# Altium schematic sheet MCU.SchDoc
size A3
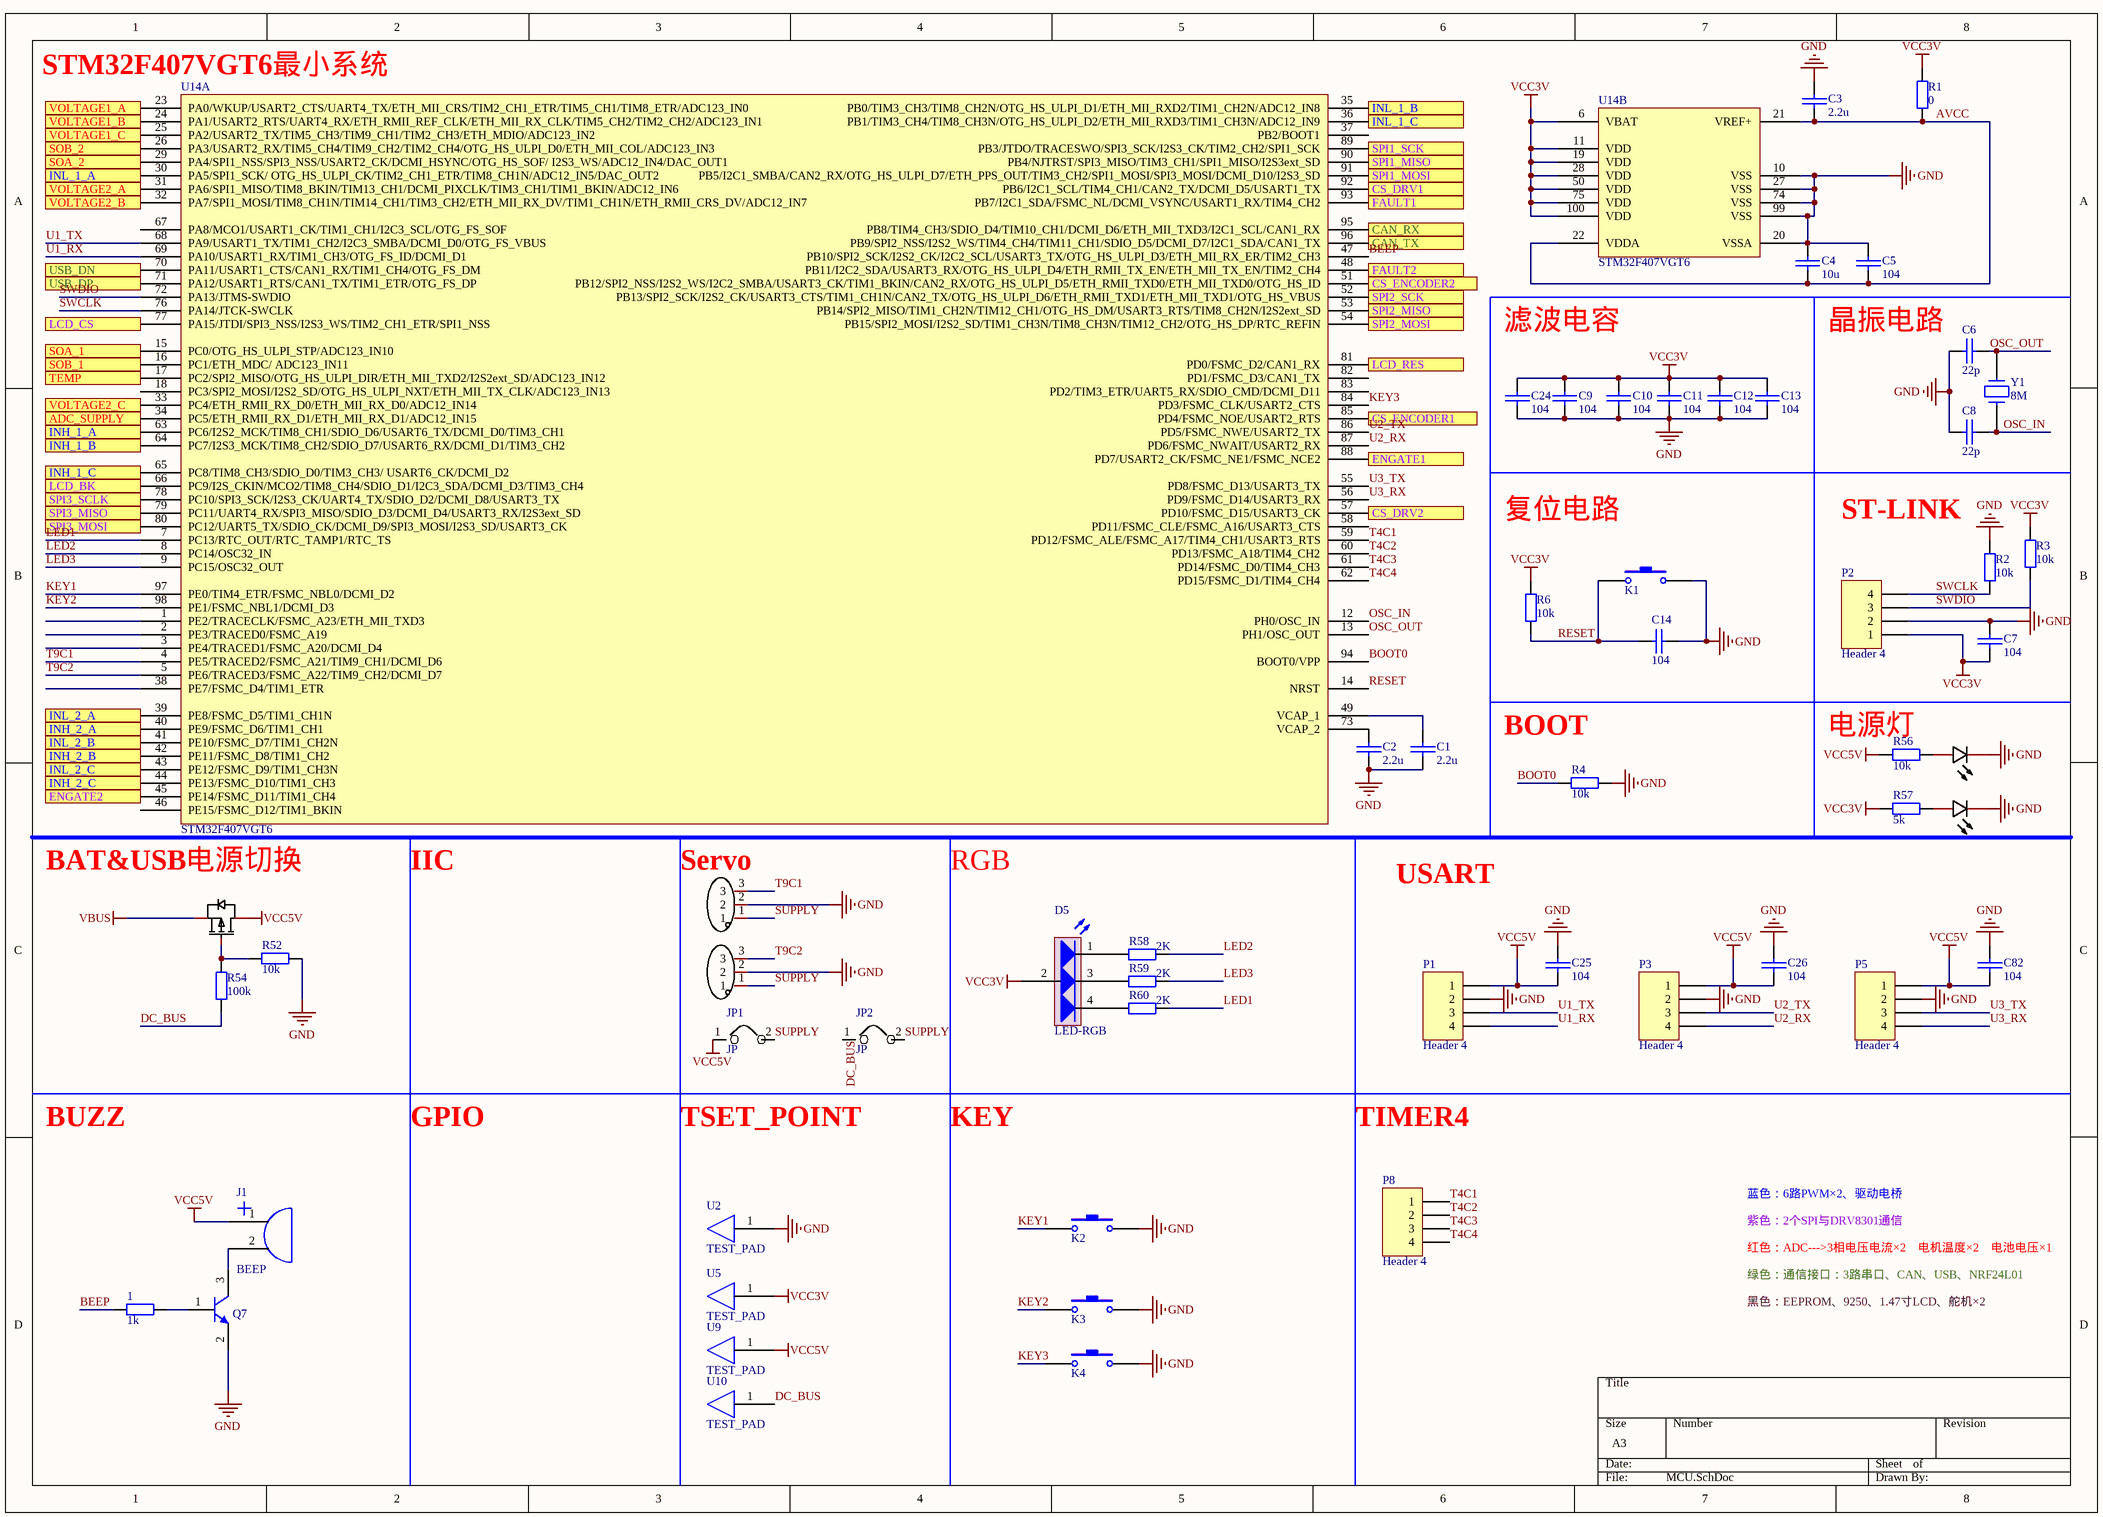
[diagram p0: MCU.SchDoc]

## Parts
1  1k  [0402C]
2  NCD0603R1_C84263  [0603LED]  (value not drawn)
3  NCD0603R1_C84263  [0603LED]  (value not drawn)
C1  value 2.2u  [0402C]  (hidden comment: CAP)
C2  value 2.2u  [0402C]  (hidden comment: CAP)
C3  value 2.2u  [0402C]  (hidden comment: CAP)
C4  value 10u  [0402C]  (hidden comment: CAP)
C5  value 104  [0402C]  (hidden comment: CAP)
C6  value 22p  [0402C]  (hidden comment: CAP)
C7  value 104  [0402C]  (hidden comment: CAP)
C8  value 22p  [0402C]  (hidden comment: CAP)
C9  value 104  [0402C]  (hidden comment: CAP)
C10  value 104  [0402C]  (hidden comment: CAP)
C11  value 104  [0402C]  (hidden comment: CAP)
C12  value 104  [0402C]  (hidden comment: CAP)
C13  value 104  [0402C]  (hidden comment: CAP)
C14  104  [0402C]
C24  value 104  [0402C]  (hidden comment: CAP)
C25  104  [0402C]
C26  104  [0402C]
C82  104  [0402C]
D5  LED-RGB  [RGB]
J1  BEEP  [无源蜂鸣器5020]
JP1  JP  [跳线]
JP2  JP  [跳线]
K1  KEY  [KEY-SMD_L3.9-W3.0-P4.45]  (value not drawn)
K2  KEY  [KEY-SMD_L3.9-W3.0-P4.45]  (value not drawn)
K3  KEY  [KEY-SMD_L3.9-W3.0-P4.45]  (value not drawn)
K4  KEY  [KEY-SMD_L3.9-W3.0-P4.45]  (value not drawn)
P1  Header 4  [A1002WR-S-4P]
P2  Header 4  [A1002WR-S-4P]
P3  Header 4  [A1002WR-S-4P]
P5  Header 4  [A1002WR-S-4P]
P8  Header 4  [A1002WR-S-4P]
Q7  NPN  [SOT-23Q]  (value not drawn)
Q15  AO3401_C727156  [SOT-23Q]  (value not drawn)
R1  0  [0402R]
R2  10k  [0402R]
R3  10k  [0402R]
R4  10k  [0402R]
R6  10k  [0402R]
R52  10k  [0402R]
R54  100k  [0402R]
R56  10k  [0402R]
R57  5k  [0402R]
R58  value 2K  [0402R]  (hidden comment: Res1)
R59  value 2K  [0402R]  (hidden comment: Res1)
R60  value 2K  [0402R]  (hidden comment: Res1)
U2  TEST_PAD  [TEST_PAD -SQUARE]
U3  MR30-M  [HDR2.54-LI-3P]  (value not drawn)
U4  MR30-M  [HDR2.54-LI-3P]  (value not drawn)
U5  TEST_PAD  [TEST_PAD -SQUARE]
U9  TEST_PAD  [TEST_PAD -SQUARE]
U10  TEST_PAD  [TEST_PAD -SQUARE]
U14  STM32F407VGT6  [LQFP-100_L14.0-W14.0-P0.50-LS16.0-BL]  (parts A,B of 2)
Y1  8M  [晶振]

## Ports
ADC_SUPPLY, CAN_RX, CAN_TX, CS_DRV1, CS_DRV2, CS_ENCODER1, CS_ENCODER2, ENGATE1, ENGATE2, FAULT1, FAULT2, INH_1_A, INH_1_B, INH_1_C, INH_2_A, INH_2_B, INH_2_C, INL_1_A, INL_1_B, INL_1_C, INL_2_A, INL_2_B, INL_2_C, LCD_BK, LCD_CS, LCD_RES, SOA_1, SOA_2, SOB_1, SOB_2, SPI1_MISO, SPI1_MOSI, SPI1_SCK, SPI2_MISO, SPI2_MOSI, SPI2_SCK, SPI3_MISO, SPI3_MOSI, SPI3_SCLK, TEMP, USB_DN, USB_DP, VOLTAGE1_A, VOLTAGE1_B, VOLTAGE1_C, VOLTAGE2_A, VOLTAGE2_B, VOLTAGE2_C

## Nets
GND: 2.1(K) 3.1(K) C1.1 C2.1 C3.2 C4.1 C5.1 C6.2 C7.1 C8.2 C9.2 C10.2 C11.2 C12.2 C13.2 C14.2 C24.2 C25.2 C26.2 C82.2 K1.2 K2.2 K3.2 K4.2 P1.2 P2.2 P3.2 P5.2 Q7.2(E) R2.2 R4.2 R52.1 U2.1 U3.2 U4.2 U14.10(VSS) U14.20(VSSA) U14.27(VSS) U14.74(VSS) U14.99(VSS)
VBUS: Q15.2(S)
VCC3V: C7.2 C9.1 C10.1 C11.1 C12.1 C13.1 C24.1 D5.2(A) P2.1 R1.1 R3.2 R6.1 R57.1 U5.1 U14.6(VBAT) U14.11(VDD) U14.19(VDD) U14.28(VDD) U14.50(VDD) U14.75(VDD) U14.100(VDD)
VCC5V: C25.1 C26.1 C82.1 J1.1 JP1.1 P1.1 P3.1 P5.1 Q15.3(D) R56.1 U9.1
ADC_SUPPLY: U14.34(PC5/ETH_RMII_RX_D1/ETH_MII_RX_D1/ADC12_IN15) ; port ADC_SUPPLY
AVCC: C3.1 C4.2 C5.2 R1.2 U14.21(VREF+) U14.22(VDDA)
BEEP: 1.1 U14.47(PB10/SPI2_SCK/I2S2_CK/I2C2_SCL/USART3_TX/OTG_HS_ULPI_D3/ETH_MII_RX_ER/TIM2_CH3)
BOOT0: R4.1 U14.94(BOOT0/VPP)
CAN_RX: U14.95(PB8/TIM4_CH3/SDIO_D4/TIM10_CH1/DCMI_D6/ETH_MII_TXD3/I2C1_SCL/CAN1_RX) ; port CAN_RX
CAN_TX: U14.96(PB9/SPI2_NSS/I2S2_WS/TIM4_CH4/TIM11_CH1/SDIO_D5/DCMI_D7/I2C1_SDA/CAN1_TX) ; port CAN_TX
CS_DRV1: U14.92(PB6/I2C1_SCL/TIM4_CH1/CAN2_TX/DCMI_D5/USART1_TX) ; port CS_DRV1
CS_DRV2: U14.57(PD10/FSMC_D15/USART3_CK) ; port CS_DRV2
CS_ENCODER1: U14.85(PD4/FSMC_NOE/USART2_RTS) ; port CS_ENCODER1
CS_ENCODER2: U14.51(PB12/SPI2_NSS/I2S2_WS/I2C2_SMBA/USART3_CK/TIM1_BKIN/CAN2_RX/OTG_HS_ULPI_D5/ETH_RMII_TXD0/ETH_MII_TXD0/OTG_HS_ID) ; port CS_ENCODER2
DC_BUS: JP2.1 R54.2 U10.1
ENGATE1: U14.88(PD7/USART2_CK/FSMC_NE1/FSMC_NCE2) ; port ENGATE1
ENGATE2: U14.45(PE14/FSMC_D11/TIM1_CH4) ; port ENGATE2
FAULT1: U14.93(PB7/I2C1_SDA/FSMC_NL/DCMI_VSYNC/USART1_RX/TIM4_CH2) ; port FAULT1
FAULT2: U14.48(PB11/I2C2_SDA/USART3_RX/OTG_HS_ULPI_D4/ETH_RMII_TX_EN/ETH_MII_TX_EN/TIM2_CH4) ; port FAULT2
INH_1_A: U14.63(PC6/I2S2_MCK/TIM8_CH1/SDIO_D6/USART6_TX/DCMI_D0/TIM3_CH1) ; port INH_1_A
INH_1_B: U14.64(PC7/I2S3_MCK/TIM8_CH2/SDIO_D7/USART6_RX/DCMI_D1/TIM3_CH2) ; port INH_1_B
INH_1_C: U14.65(PC8/TIM8_CH3/SDIO_D0/TIM3_CH3/_USART6_CK/DCMI_D2) ; port INH_1_C
INH_2_A: U14.40(PE9/FSMC_D6/TIM1_CH1) ; port INH_2_A
INH_2_B: U14.42(PE11/FSMC_D8/TIM1_CH2) ; port INH_2_B
INH_2_C: U14.44(PE13/FSMC_D10/TIM1_CH3) ; port INH_2_C
INL_1_A: U14.30(PA5/SPI1_SCK/_OTG_HS_ULPI_CK/TIM2_CH1_ETR/TIM8_CH1N/ADC12_IN5/DAC_OUT2) ; port INL_1_A
INL_1_B: U14.35(PB0/TIM3_CH3/TIM8_CH2N/OTG_HS_ULPI_D1/ETH_MII_RXD2/TIM1_CH2N/ADC12_IN8) ; port INL_1_B
INL_1_C: U14.36(PB1/TIM3_CH4/TIM8_CH3N/OTG_HS_ULPI_D2/ETH_MII_RXD3/TIM1_CH3N/ADC12_IN9) ; port INL_1_C
INL_2_A: U14.39(PE8/FSMC_D5/TIM1_CH1N) ; port INL_2_A
INL_2_B: U14.41(PE10/FSMC_D7/TIM1_CH2N) ; port INL_2_B
INL_2_C: U14.43(PE12/FSMC_D9/TIM1_CH3N) ; port INL_2_C
KEY1: K2.1 U14.97(PE0/TIM4_ETR/FSMC_NBL0/DCMI_D2)
KEY2: K3.1 U14.98(PE1/FSMC_NBL1/DCMI_D3)
KEY3: K4.1 U14.84(PD3/FSMC_CLK/USART2_CTS)
LCD_BK: U14.66(PC9/I2S_CKIN/MCO2/TIM8_CH4/SDIO_D1/I2C3_SDA/DCMI_D3/TIM3_CH4) ; port LCD_BK
LCD_CS: U14.77(PA15/JTDI/SPI3_NSS/I2S3_WS/TIM2_CH1_ETR/SPI1_NSS) ; port LCD_CS
LCD_RES: U14.81(PD0/FSMC_D2/CAN1_RX) ; port LCD_RES
LED1: R60.2 U14.7(PC13/RTC_OUT/RTC_TAMP1/RTC_TS)
LED2: R58.2 U14.8(PC14/OSC32_IN)
LED3: R59.2 U14.9(PC15/OSC32_OUT)
OSC_IN: C8.1 U14.12(PH0/OSC_IN) Y1.2
OSC_OUT: C6.1 U14.13(PH1/OSC_OUT) Y1.1
RESET: C14.1 K1.1 R6.2 U14.14(NRST)
SOA_1: U14.15(PC0/OTG_HS_ULPI_STP/ADC123_IN10) ; port SOA_1
SOA_2: U14.29(PA4/SPI1_NSS/SPI3_NSS/USART2_CK/DCMI_HSYNC/OTG_HS_SOF/_I2S3_WS/ADC12_IN4/DAC_OUT1) ; port SOA_2
SOB_1: U14.16(PC1/ETH_MDC/_ADC123_IN11) ; port SOB_1
SOB_2: U14.26(PA3/USART2_RX/TIM5_CH4/TIM9_CH2/TIM2_CH4/OTG_HS_ULPI_D0/ETH_MII_COL/ADC123_IN3) ; port SOB_2
SPI1_MISO: U14.90(PB4/NJTRST/SPI3_MISO/TIM3_CH1/SPI1_MISO/I2S3ext_SD) ; port SPI1_MISO
SPI1_MOSI: U14.91(PB5/I2C1_SMBA/CAN2_RX/OTG_HS_ULPI_D7/ETH_PPS_OUT/TIM3_CH2/SPI1_MOSI/SPI3_MOSI/DCMI_D10/I2S3_SD) ; port SPI1_MOSI
SPI1_SCK: U14.89(PB3/JTDO/TRACESWO/SPI3_SCK/I2S3_CK/TIM2_CH2/SPI1_SCK) ; port SPI1_SCK
SPI2_MISO: U14.53(PB14/SPI2_MISO/TIM1_CH2N/TIM12_CH1/OTG_HS_DM/USART3_RTS/TIM8_CH2N/I2S2ext_SD) ; port SPI2_MISO
SPI2_MOSI: U14.54(PB15/SPI2_MOSI/I2S2_SD/TIM1_CH3N/TIM8_CH3N/TIM12_CH2/OTG_HS_DP/RTC_REFIN) ; port SPI2_MOSI
SPI2_SCK: U14.52(PB13/SPI2_SCK/I2S2_CK/USART3_CTS/TIM1_CH1N/CAN2_TX/OTG_HS_ULPI_D6/ETH_RMII_TXD1/ETH_MII_TXD1/OTG_HS_VBUS) ; port SPI2_SCK
SPI3_MISO: U14.79(PC11/UART4_RX/SPI3_MISO/SDIO_D3/DCMI_D4/USART3_RX/I2S3ext_SD) ; port SPI3_MISO
SPI3_MOSI: U14.80(PC12/UART5_TX/SDIO_CK/DCMI_D9/SPI3_MOSI/I2S3_SD/USART3_CK) ; port SPI3_MOSI
SPI3_SCLK: U14.78(PC10/SPI3_SCK/I2S3_CK/UART4_TX/SDIO_D2/DCMI_D8/USART3_TX) ; port SPI3_SCLK
SUPPLY: JP1.2 JP2.2 U3.1 U4.1
SWCLK: P2.4 R2.1 U14.76(PA14/JTCK-SWCLK)
SWDIO: P2.3 R3.1 U14.72(PA13/JTMS-SWDIO)
T4C1: P8.1 U14.59(PD12/FSMC_ALE/FSMC_A17/TIM4_CH1/USART3_RTS)
T4C2: P8.2 U14.60(PD13/FSMC_A18/TIM4_CH2)
T4C3: P8.3 U14.61(PD14/FSMC_D0/TIM4_CH3)
T4C4: P8.4 U14.62(PD15/FSMC_D1/TIM4_CH4)
T9C1: U3.3 U14.4(PE5/TRACED2/FSMC_A21/TIM9_CH1/DCMI_D6)
T9C2: U4.3 U14.5(PE6/TRACED3/FSMC_A22/TIM9_CH2/DCMI_D7)
TEMP: U14.17(PC2/SPI2_MISO/OTG_HS_ULPI_DIR/ETH_MII_TXD2/I2S2ext_SD/ADC123_IN12) ; port TEMP
U1_RX: P1.4 U14.69(PA10/USART1_RX/TIM1_CH3/OTG_FS_ID/DCMI_D1)
U1_TX: P1.3 U14.68(PA9/USART1_TX/TIM1_CH2/I2C3_SMBA/DCMI_D0/OTG_FS_VBUS)
U2_RX: P3.4 U14.87(PD6/FSMC_NWAIT/USART2_RX)
U2_TX: P3.3 U14.86(PD5/FSMC_NWE/USART2_TX)
U3_RX: P5.4 U14.56(PD9/FSMC_D14/USART3_RX)
U3_TX: P5.3 U14.55(PD8/FSMC_D13/USART3_TX)
USB_DN: U14.70(PA11/USART1_CTS/CAN1_RX/TIM1_CH4/OTG_FS_DM) ; port USB_DN
USB_DP: U14.71(PA12/USART1_RTS/CAN1_TX/TIM1_ETR/OTG_FS_DP) ; port USB_DP
VOLTAGE1_A: U14.23(PA0/WKUP/USART2_CTS/UART4_TX/ETH_MII_CRS/TIM2_CH1_ETR/TIM5_CH1/TIM8_ETR/ADC123_IN0) ; port VOLTAGE1_A
VOLTAGE1_B: U14.24(PA1/USART2_RTS/UART4_RX/ETH_RMII_REF_CLK/ETH_MII_RX_CLK/TIM5_CH2/TIM2_CH2/ADC123_IN1) ; port VOLTAGE1_B
VOLTAGE1_C: U14.25(PA2/USART2_TX/TIM5_CH3/TIM9_CH1/TIM2_CH3/ETH_MDIO/ADC123_IN2) ; port VOLTAGE1_C
VOLTAGE2_A: U14.31(PA6/SPI1_MISO/TIM8_BKIN/TIM13_CH1/DCMI_PIXCLK/TIM3_CH1/TIM1_BKIN/ADC12_IN6) ; port VOLTAGE2_A
VOLTAGE2_B: U14.32(PA7/SPI1_MOSI/TIM8_CH1N/TIM14_CH1/TIM3_CH2/ETH_MII_RX_DV/TIM1_CH1N/ETH_RMII_CRS_DV/ADC12_IN7) ; port VOLTAGE2_B
VOLTAGE2_C: U14.33(PC4/ETH_RMII_RX_D0/ETH_MII_RX_D0/ADC12_IN14) ; port VOLTAGE2_C
Net1_2: 1.2 Q7.1(B)
Net2_2: 2.2(A) R56.2
Net3_2: 3.2(A) R57.2
NetC1_2: C1.2 U14.49(VCAP_1)
NetC2_2: C2.2 U14.73(VCAP_2)
NetD5_1: D5.1(R) R58.1
NetD5_3: D5.3(G) R59.1
NetD5_4: D5.4(B) R60.1
NetJ1_2: J1.2 Q7.3(C)
NetQ15_1: Q15.1(G) R52.2 R54.1

Not connected (* = marked no-connect by the designer): U14 1(PE2/TRACECLK/FSMC_A23/ETH_MII_TXD3) 2(PE3/TRACED0/FSMC_A19) 3(PE4/TRACED1/FSMC_A20/DCMI_D4) 18(PC3/SPI2_MOSI/I2S2_SD/OTG_HS_ULPI_NXT/ETH_MII_TX_CLK/ADC123_IN13) 37(PB2/BOOT1) 38(PE7/FSMC_D4/TIM1_ETR) 46(PE15/FSMC_D12/TIM1_BKIN) 58(PD11/FSMC_CLE/FSMC_A16/USART3_CTS) 67(PA8/MCO1/USART1_CK/TIM1_CH1/I2C3_SCL/OTG_FS_SOF) 82(PD1/FSMC_D3/CAN1_TX) 83(PD2/TIM3_ETR/UART5_RX/SDIO_CMD/DCMI_D11)

## Notes on the sheet
- (near U14) STM32F407VGT6最小系统
- 滤波电容
- 晶振电路
- 复位电路
- ST-LINK
- (near R4) BOOT
- (near R56) 电源灯
- BAT&USB电源切换
- (near U14) IIC
- (near U3) Servo
- (near U14) RGB
- USART
- BUZZ
- GPIO
- TSET_POINT
- KEY
- TIMER4
- 蓝色：6路PWM×2、驱动电桥
- 紫色：2个SPI与DRV8301通信
- 红色：ADC--->3相电压电流×2    电机温度×2    电池电压×1
- 绿色：通信接口：3路串口、CAN、USB、NRF24L01
- 黑色：EEPROM、9250、1.47寸LCD、舵机×2

## Library data of the parts
1 R1 R54 R57 = Res2: Resistor; Value: 10K; Published: 8-Jun-2000; LatestRevisionDate: 17-Jul-2002; LatestRevisionNote: Re-released for DXP Platform.; PackageReference: AXIAL-0.4; Publisher: Altium Limited; PackageDescription: Axial Device, Thru-Hole; 2 Leads; 0.4 in Pin Spacing
2 3 = 0603LED: Manufacturer: 国星光电; Symbol: FC-DA1608HRK-620D; Add into BOM: yes; Emitted Color: 红色; Forward Voltage (VF): 1.6V~2.6V; Power Dissipation: 65mW; Forward Current: 20mA; Dominant Wavelength: 615nm~630nm; Diode Configuration: 独立二极管; Lens Color: 无色透明; Luminous Intensity: 80mcd~220mcd; Viewing Angle: 130°; Device: NCD0603R1_C84263; Supplier: LCSC; Manufacturer Part: NCD0603R1; Supplier Part: C84263; JLCPCB Part Class: Extended Part; LCSC Part Name: NCD0603R1; Supplier Footprint: 0603; Datasheet: https://atta.szlcsc.com/upload/public/pdf/source/20200820/C84263_DABC6A75E58F576973B407FDBA283D60.pdf; Convert to PCB: yes; Lamp Holder Type: -; Peak Wavelength: -; Color Temperature: -; Mounting Sytle: -; Operating Temperature: -30℃~+85℃
C14 = CAP: Value: 104
C25 C26 C82 = C: Capacitor
D5 = LED-RGB: 三基色LED; Published: 8-Jun-2000; LatestRevisionDate: 08-Jul-2005; LatestRevisionNote: Mech Layer 1 removed.; PackageReference: LED-0; Publisher: Altium Limited
J1 = BEEP: 蜂鸣器
K1-K4 = KEY_1
P1-P3 P5 P8 = Header 4: Header, 4-Pin; LatestRevisionDate: 17-Jul-2002; LatestRevisionNote: Re-released for DXP Platform.; Publisher: Altium Limited
Q15 = PMOS: Manufacturer: TWGMC(台湾迪嘉); Name: AO3401; Add into BOM: yes; Type: P沟道; Drain Source Voltage (Vdss): 30V; Continuous Drain Current (Id): 4.2A; Power Dissipation (Pd): 350mW; Drain Source On Resistance (RDS(on)@Vgs,Id): 65mΩ@10V,4.2A; Gate Threshold Voltage (Vgs(th)@Id): 1.3V@250uA; Symbol: AO3401_C727156; Device: AO3401_C727156; LCSC Part Name: P沟道 耐压:30V 电流:4.2A; Supplier Part: C727156; Manufacturer Part: AO3401; Supplier Footprint: SOT-23; JLCPCB Part Class: Extended Part; Datasheet: https://atta.szlcsc.com/upload/public/pdf/source/20200827/C727156_6E081BBEEFBC6B8FEE164CB196B0AF30.pdf; Supplier: LCSC; Convert to PCB: yes; Total Gate Charge (Qg@Vgs): -; Input Capacitance (Ciss@Vds): -; Reverse Transfer Capacitance (Crss@Vds): -; Operating Temperature: -
R2-R4 R6 R52 R56 = Res2: Resistor; Published: 8-Jun-2000; LatestRevisionDate: 17-Jul-2002; LatestRevisionNote: Re-released for DXP Platform.; PackageReference: AXIAL-0.4; Publisher: Altium Limited; PackageDescription: Axial Device, Thru-Hole; 2 Leads; 0.4 in Pin Spacing; Value: 10K
R58-R60 = Res1: 贴片电阻; Published: 8-Jun-2000; LatestRevisionDate: 17-Jul-2002; LatestRevisionNote: Re-released for DXP Platform.; PackageReference: AXIAL-0.4; Publisher: Altium Limited
U3 U4 = MR30-M: Manufacturer: AMASS(艾迈斯); Add into BOM: yes; Name: MR30-M; Symbol: MR30-M; Device: MR30-M; LCSC Part Name: MR30-M 两件套; Supplier Part: C99873; Manufacturer Part: MR30-M; Supplier Footprint: -; JLCPCB Part Class: Extended Part; Datasheet: https://atta.szlcsc.com/upload/public/pdf/source/20170412/1491969315720.pdf; Supplier: LCSC; Convert to PCB: yes
Y1 = CRYSTAL